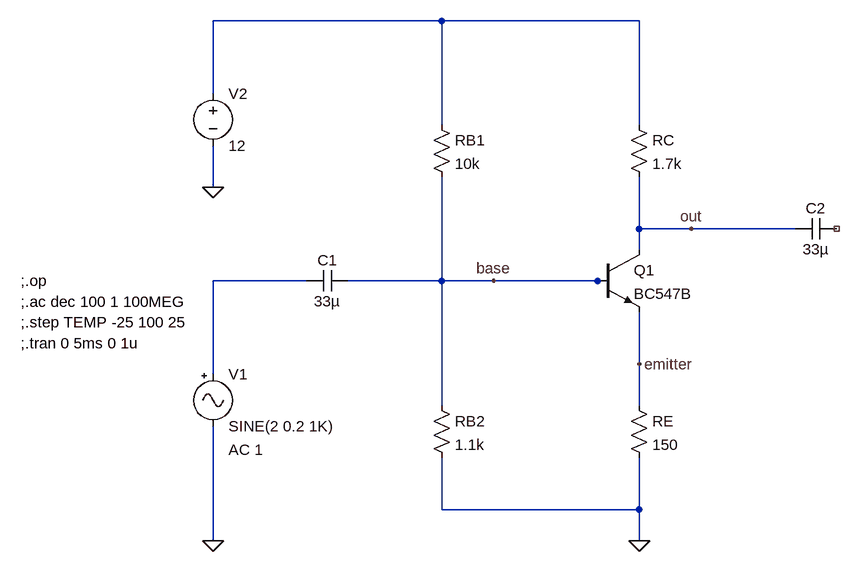
[diagram p0: schematic Lab1.asc]
Lab1.asc, the LTspice schematic file:
Version 4
SHEET 1 880 680
WIRE 0 -272 -352 -272
WIRE 304 -272 0 -272
WIRE -352 -160 -352 -272
WIRE 0 -112 0 -272
WIRE 304 -112 304 -272
WIRE -352 -16 -352 -80
WIRE 304 48 304 -32
WIRE 384 48 304 48
WIRE 544 48 384 48
WIRE 304 80 304 48
WIRE -208 128 -352 128
WIRE 0 128 0 -32
WIRE 0 128 -144 128
WIRE 80 128 0 128
WIRE 240 128 80 128
WIRE 256 128 240 128
WIRE 304 256 304 176
WIRE -352 272 -352 128
WIRE 0 320 0 128
WIRE 304 320 304 256
WIRE 0 480 0 400
WIRE 304 480 304 400
WIRE 304 480 0 480
WIRE -352 528 -352 352
WIRE 304 528 304 480
FLAG 304 528 0
FLAG -352 -16 0
FLAG -352 528 0
FLAG 384 48 out
FLAG 304 256 emitter
FLAG 80 128 base
SYMBOL npn 240 80 R0
SYMATTR InstName Q1
SYMATTR Value BC547B
SYMBOL res 288 304 R0
SYMATTR InstName RE
SYMATTR Value 150
SYMBOL res -16 304 R0
SYMATTR InstName RB2
SYMATTR Value 1.1k
SYMBOL res 288 -128 R0
SYMATTR InstName RC
SYMATTR Value 1.7k
SYMBOL res -16 -128 R0
SYMATTR InstName RB1
SYMATTR Value 10k
SYMBOL cap -144 112 R90
WINDOW 0 0 32 VBottom 2
WINDOW 3 32 32 VTop 2
SYMATTR InstName C1
SYMATTR Value 33µ
SYMBOL cap 608 32 R90
WINDOW 0 0 32 VBottom 2
WINDOW 3 32 32 VTop 2
SYMATTR InstName C2
SYMATTR Value 33µ
SYMBOL Misc\\signal -352 256 R0
WINDOW 123 24 132 Left 2
WINDOW 39 0 0 Left 0
SYMATTR InstName V1
SYMATTR Value SINE(2 0.2 1K)
SYMATTR Value2 AC 1
SYMBOL voltage -352 -176 R0
WINDOW 123 0 0 Left 0
WINDOW 39 0 0 Left 0
SYMATTR InstName V2
SYMATTR Value 12
TEXT -648 128 Left 2 !;.op
TEXT -648 160 Left 2 !;.ac dec 100 1 100MEG
TEXT -648 192 Left 2 !;.step TEMP -25 100 25
TEXT -648 224 Left 2 !;.tran 0 5ms 0 1u

The netlist it stands for:
* Lab1.asc
Q1 out base emitter 0 BC547B
RE emitter 0 150
RB2 base 0 1.1k
RC N001 out 1.7k
RB1 N001 base 10k
C1 base N002 33µ
C2 NC_01 out 33µ
V1 N002 0 SINE(2 0.2 1K) AC 1
V2 N001 0 12
.model NPN NPN
.model PNP PNP
.lib standard.bjt
;.op
;.ac dec 100 1 100MEG
;.step TEMP -25 100 25
;.tran 0 5ms 0 1u
.backanno
.end